# Altium schematic sheet nrf52840_wlcsp.SchDoc
size A3
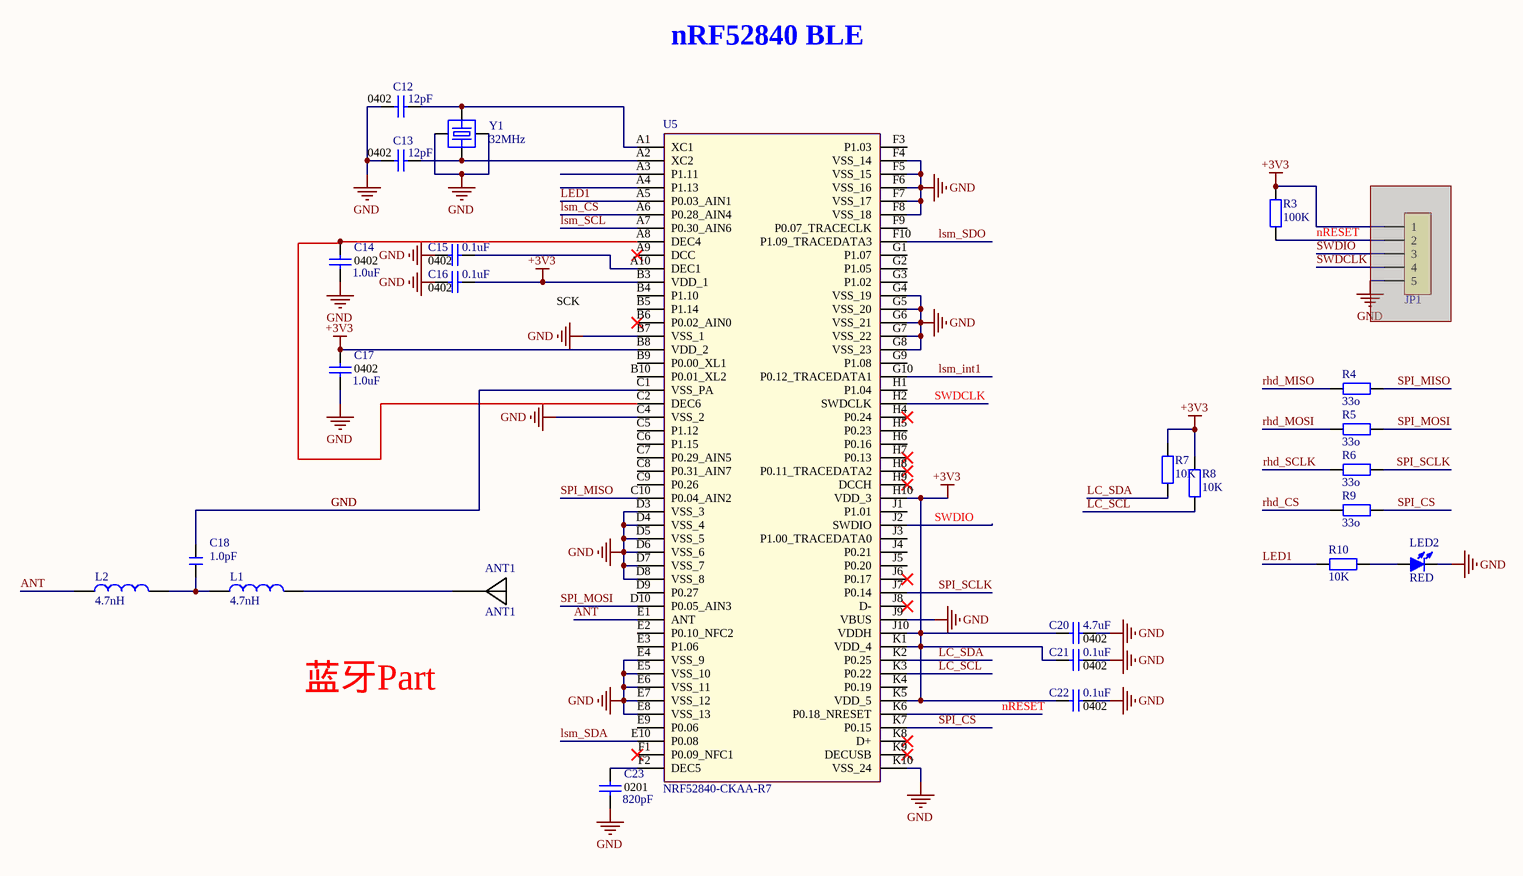
[diagram p0: nrf52840_wlcsp.SchDoc]

## Parts
ANT1  ANT1  [ANT-SMD_2P-L3.20-W1.60]
C12  12pF  Package: 0402  [C 0201_L]
C13  12pF  Package: 0402  [C 0201_L]
C14  1.0uF  Package: 0402  [C 0201_L]
C15  0.1uF  Package: 0402  [C 0201_L]
C16  0.1uF  Package: 0402  [C 0201_L]
C17  1.0uF  Package: 0402  [C 0201_L]
C18  1.0pF  [C 0201_L]
C20  4.7uF  Package: 0402  [C 0201_L]
C21  0.1uF  Package: 0402  [C 0201_L]
C22  0.1uF  Package: 0402  [C 0201_L]
C23  820pF  Package: 0201  [C 0201_L]
JP1  HDR-1X5  [FPC_05P-0.5mm-RA-SMD]  (value not drawn)  (masked out: inside a compile mask, not in the netlist)
L1  4.7nH  [L0201]
L2  4.7nH  [L0201]
LED2  RED  [LED-SMD_L0.7-W0.4-RD_BLUE - duplicate]
R3  100K  [R 0201_L]
R4  33o  [R 0201_L]
R5  33o  [R 0201_L]
R6  33o  [R 0201_L]
R7  10K  [R 0201_L]
R8  10K  [R 0201_L]
R9  33o  [R 0201_L]
R10  10K  [R 0201_L]
U5  NRF52840-CKAA-R7  [BGA94C35P10X10_354X361X51]
Y1  32MHz  [OSC 1612-4P]

## Nets
+3V3: C16.1 C17.1 C20.2 C21.2 C22.2 R3.2 R7.2 R8.2 U5.B3(VDD_1) U5.B8(VDD_2) U5.H10(VDD_3) U5.J10(VDDH) U5.K1(VDD_4) U5.K5(VDD_5)
GND: C12.2 C13.2 C14.2 C15.2 C16.2 C17.2 C18.1 C20.1 C21.1 C22.1 C23.2 LED2.2(K) U5.B7(VSS_1) U5.C1(VSS_PA) U5.C4(VSS_2) U5.D3(VSS_3) U5.D4(VSS_4) U5.D5(VSS_5) U5.D6(VSS_6) U5.D7(VSS_7) U5.D8(VSS_8) U5.E4(VSS_9) U5.E5(VSS_10) U5.E6(VSS_11) U5.E7(VSS_12) U5.E8(VSS_13) U5.F4(VSS_14) U5.F5(VSS_15) U5.F6(VSS_16) U5.F7(VSS_17) U5.F8(VSS_18) U5.G4(VSS_19) U5.G5(VSS_20) U5.G6(VSS_21) U5.G7(VSS_22) U5.G8(VSS_23) U5.J9(VBUS) U5.K10(VSS_24) Y1.2(GND) Y1.4(GND)
ANT: L2.1 U5.E1(ANT)
LC_SCL: R8.1 U5.K3(P0.22)
LC_SDA: R7.1 U5.K2(P0.25)
LED1: R10.1 U5.A5(P0.03_AIN1)
lsm_CS: U5.A6(P0.28_AIN4)
lsm_int1: U5.G10(P0.12_TRACEDATA1)
lsm_SCL: U5.A7(P0.30_AIN6)
lsm_SDA: U5.E10(P0.08)
lsm_SDO: U5.F10(P1.09_TRACEDATA3)
nRESET: R3.1 U5.K6(P0.18_NRESET)
rhd_CS: R9.1
rhd_MISO: R4.1
rhd_MOSI: R5.1
rhd_SCLK: R6.1
SPI_CS: R9.2 U5.K7(P0.15)
SPI_MISO: R4.2 U5.C10(P0.04_AIN2)
SPI_MOSI: R5.2 U5.D10(P0.05_AIN3)
SPI_SCLK: R6.2 U5.J7(P0.14)
SWDCLK: U5.H2(SWDCLK)
SWDIO: U5.J2(SWDIO)
NetANT1_1: ANT1.1 L1.2
NetC12_1: C12.1 U5.A1(XC1) Y1.1(I/O)
NetC13_1: C13.1 U5.A2(XC2) Y1.3(O/I)
NetC14_1: C14.1 U5.A8(DEC4) U5.C2(DEC6)
NetC15_1: C15.1 U5.A10(DEC1)
NetC18_2: C18.2 L1.1 L2.2
NetC23_1: C23.1 U5.F2(DEC5)
NetLED2_1: LED2.1(A) R10.2

Not connected (* = marked no-connect by the designer): U5 A3(P1.11) A4(P1.13) A9(DCC)* B4(P1.10) B5(P1.14) B6(P0.02_AIN0)* B9(P0.00_XL1) B10(P0.01_XL2) C5(P1.12) C6(P1.15) C7(P0.29_AIN5) C8(P0.31_AIN7) C9(P0.26) D9(P0.27) E2(P0.10_NFC2) E3(P1.06) E9(P0.06) F1(P0.09_NFC1)* F3(P1.03) F9(P0.07_TRACECLK) G1(P1.07) G2(P1.05) G3(P1.02) G9(P1.08) H1(P1.04) H4(P0.24)* H5(P0.23) H6(P0.16) H7(P0.13)* H8(P0.11_TRACEDATA2)* H9(DCCH)* J1(P1.01) J3(P1.00_TRACEDATA0) J4(P0.21) J5(P0.20) J6(P0.17)* J8(D-)* K4(P0.19) K8(D+)* K9(DECUSB)*

## Notes on the sheet
- nRF52840 BLE
- 蓝牙Part
- Labels drawn without touching a wire or pin: SCK

## Library data of the parts
ANT1 = ANT1: PCB板载天线; 版权归属: 封装库来自淘宝 ID：黄晶宝石; BOM名称: PCB板载天线; 技术支持，联系售后: https://shop463601444.taobao.com
C12 C13 = CAP CER 12PF 50V C0G/NP0 0402: Manufacturer Part Number: CC0402GRNPO9BN120; Manufacturer: YAGEO; Supplier Part Number 1: 311-3609-1-ND; Height: 0.55mm; Supplier 1: Digi-Key; value: 12pF
C14 C17 = CAP CER 1UF 16V X7R 0603: Manufacturer Part Number: C0603C105K4RAC7867; Manufacturer: KEMET; Supplier Part Number 1: 399-C0603C105K4RAC7867CT-ND; Height: 0.9mm; Supplier 1: Digi-Key; value: 1.0uF
C15 C16 C21 C22 = CAP CER 0.1UF 6.3V X7R 0201: Manufacturer Part Number: CC0201KRX7R5BB104; Manufacturer: YAGEO; Supplier Part Number 1: 13-CC0201KRX7R5BB104CT-ND; Height: 0.33mm; Supplier 1: Digi-Key; value: 0.1uF
C18 = C: 贴片电容; BOM名称: 无极性贴片电容; value: 1.0pF
C20 = CAP CER 4.7UF 6.3V X7R 0603: Manufacturer Part Number: JMK107BB7475KA-T; Manufacturer: Taiyo Yuden; Supplier Part Number 1: 587-5870-1-ND; Height: 1.0mm; Supplier 1: Digi-Key; value: 4.7uF
C23 = CAP CER 820PF 25V X7R 0201: Manufacturer Part Number: CC0201KRX7R8BB821; Manufacturer: YAGEO; Supplier Part Number 1: 311-3698-1-ND; Height: 0.33mm; Supplier 1: Digi-Key; value: 820pF
JP1 = Header 5: 5P接插件; 学习资源: 封装库来自淘宝 ID：黄晶宝石; BOM名称: 5P接插件; 联系售后: https://shop463601444.taobao.com
L1 L2 = L: 小功率贴片电感; BOM名称: 小功率贴片电感; Value: 4.7nH
LED2 = LED-SMD: 贴片LED; BOM名称: 贴片LED; Color: RED
R3-R10 = R: 贴片电阻; BOM名称: 贴片电阻
  R3: Value: 100K
  R4-R6 R9: Value: 33o
  R7 R8 R10: Value: 10K
U5 = NRF52840-CKAA-R7: Advanced Bluetooth 5, Thread and Zigbee multiprotocol SoC; Manufacturer: Nordic Semiconductor; Supplier 1: Mouser; Manufacturer Part Number: NRF52840-CKAA-R7; RoHS: Yes; Category: RF Receivers, Transceivers; Pricing 1: 1=6.69000, 10=6.04000, 50=5.76000, 100=5.00000, 1000=5.00000, 10000=5.00000 (USD); Supplier Part Number 1: 949-NRF52840-CKAA-R7
Y1 = XTAL_ECS-320-8-37BQ-CKY-TR: Crystal 32MHz 8pF ±10ppm ±10ppm 4-Pin Miniature CSMD T/R; Manufacturer: ECS International; Supplier 1: Digi-Key; Manufacturer Part Number: ECS-320-8-37BQ-CKY-TR; RoHS: No; Stock 1: 8978; Pricing 1: 1=0.57000, 10=0.47700, 50=0.42960, 100=0.38180, 500=0.36270 (USD); Supplier Part Number 1: 50-ECS-320-8-37BQ-CKY-CT-ND